# EasyEDA Pro project ProPrj_嵌赛国赛_2025-08-15.epro, schematic 药箱电源板

## Sheets
1 P1: Board Name: 药箱电源板; Create Date: 2025-07-22; Page Name: P1; Project Name: 嵌赛国赛; Schematic Name: 药箱电源板; Update Date: 2025-07-22; Company: 嘉立创EDA; Page Size: A4; Version: V1.0
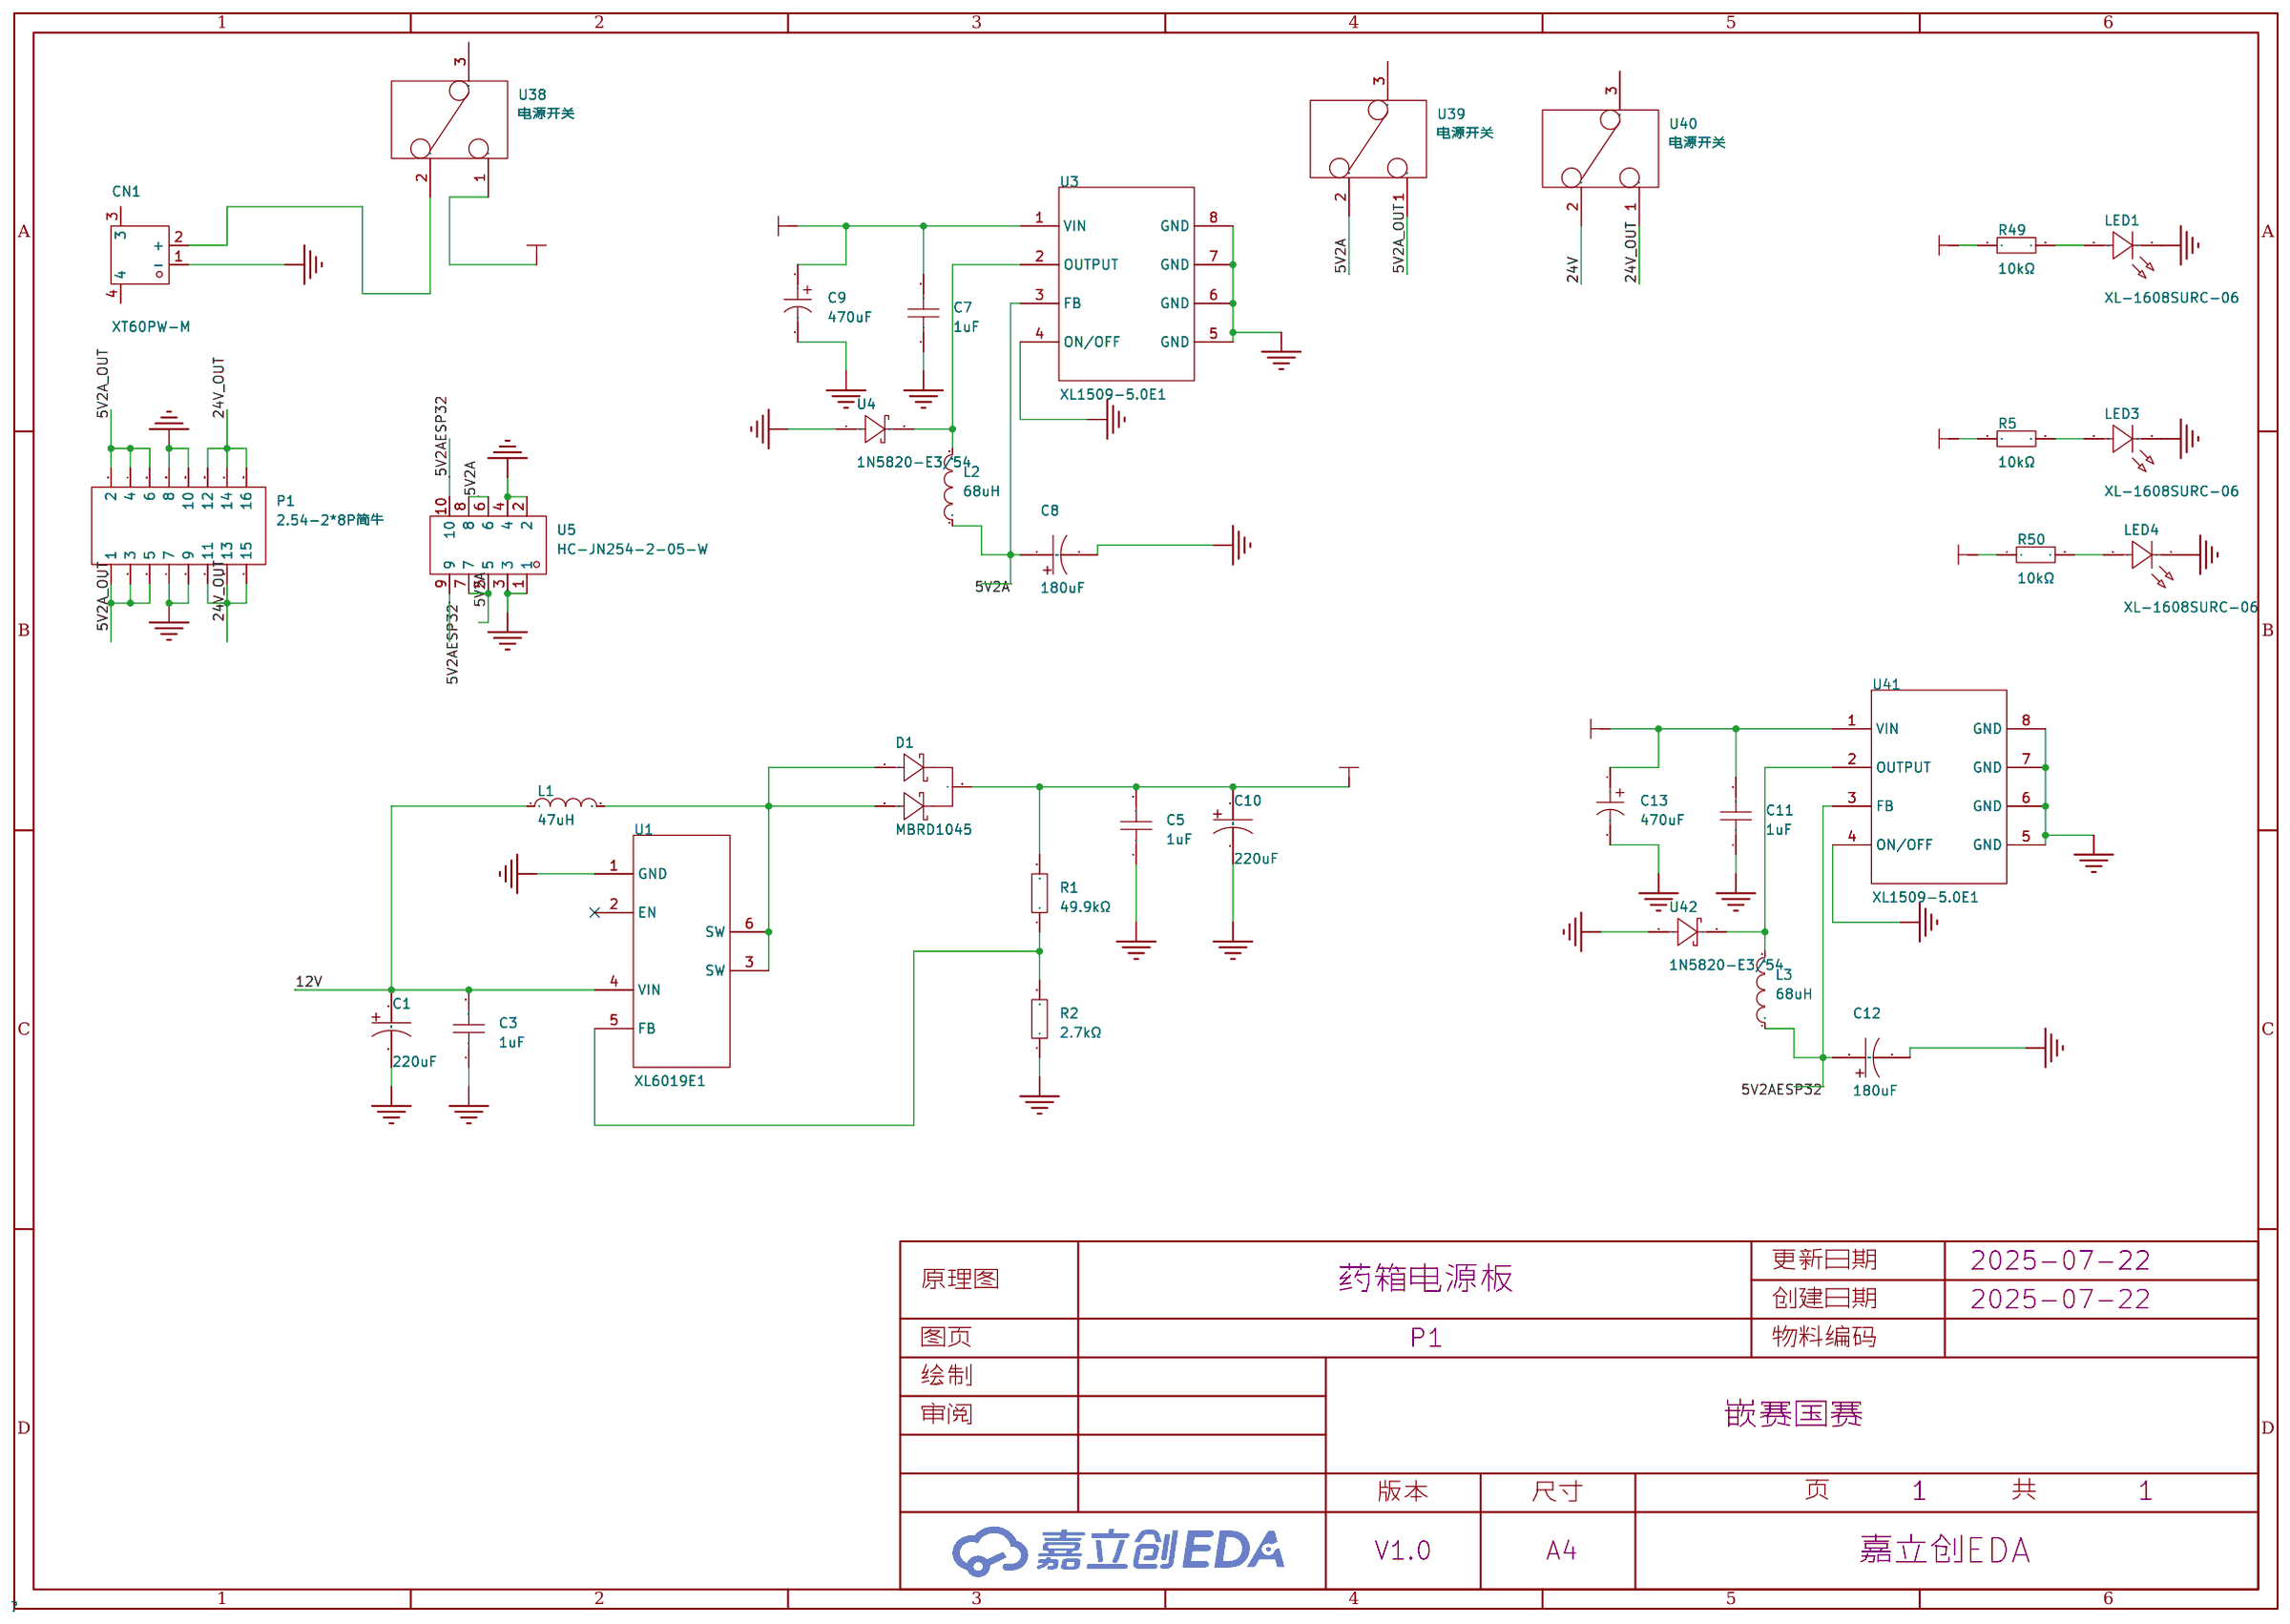
[diagram p6: P1]
2 P2: Page Name: P2
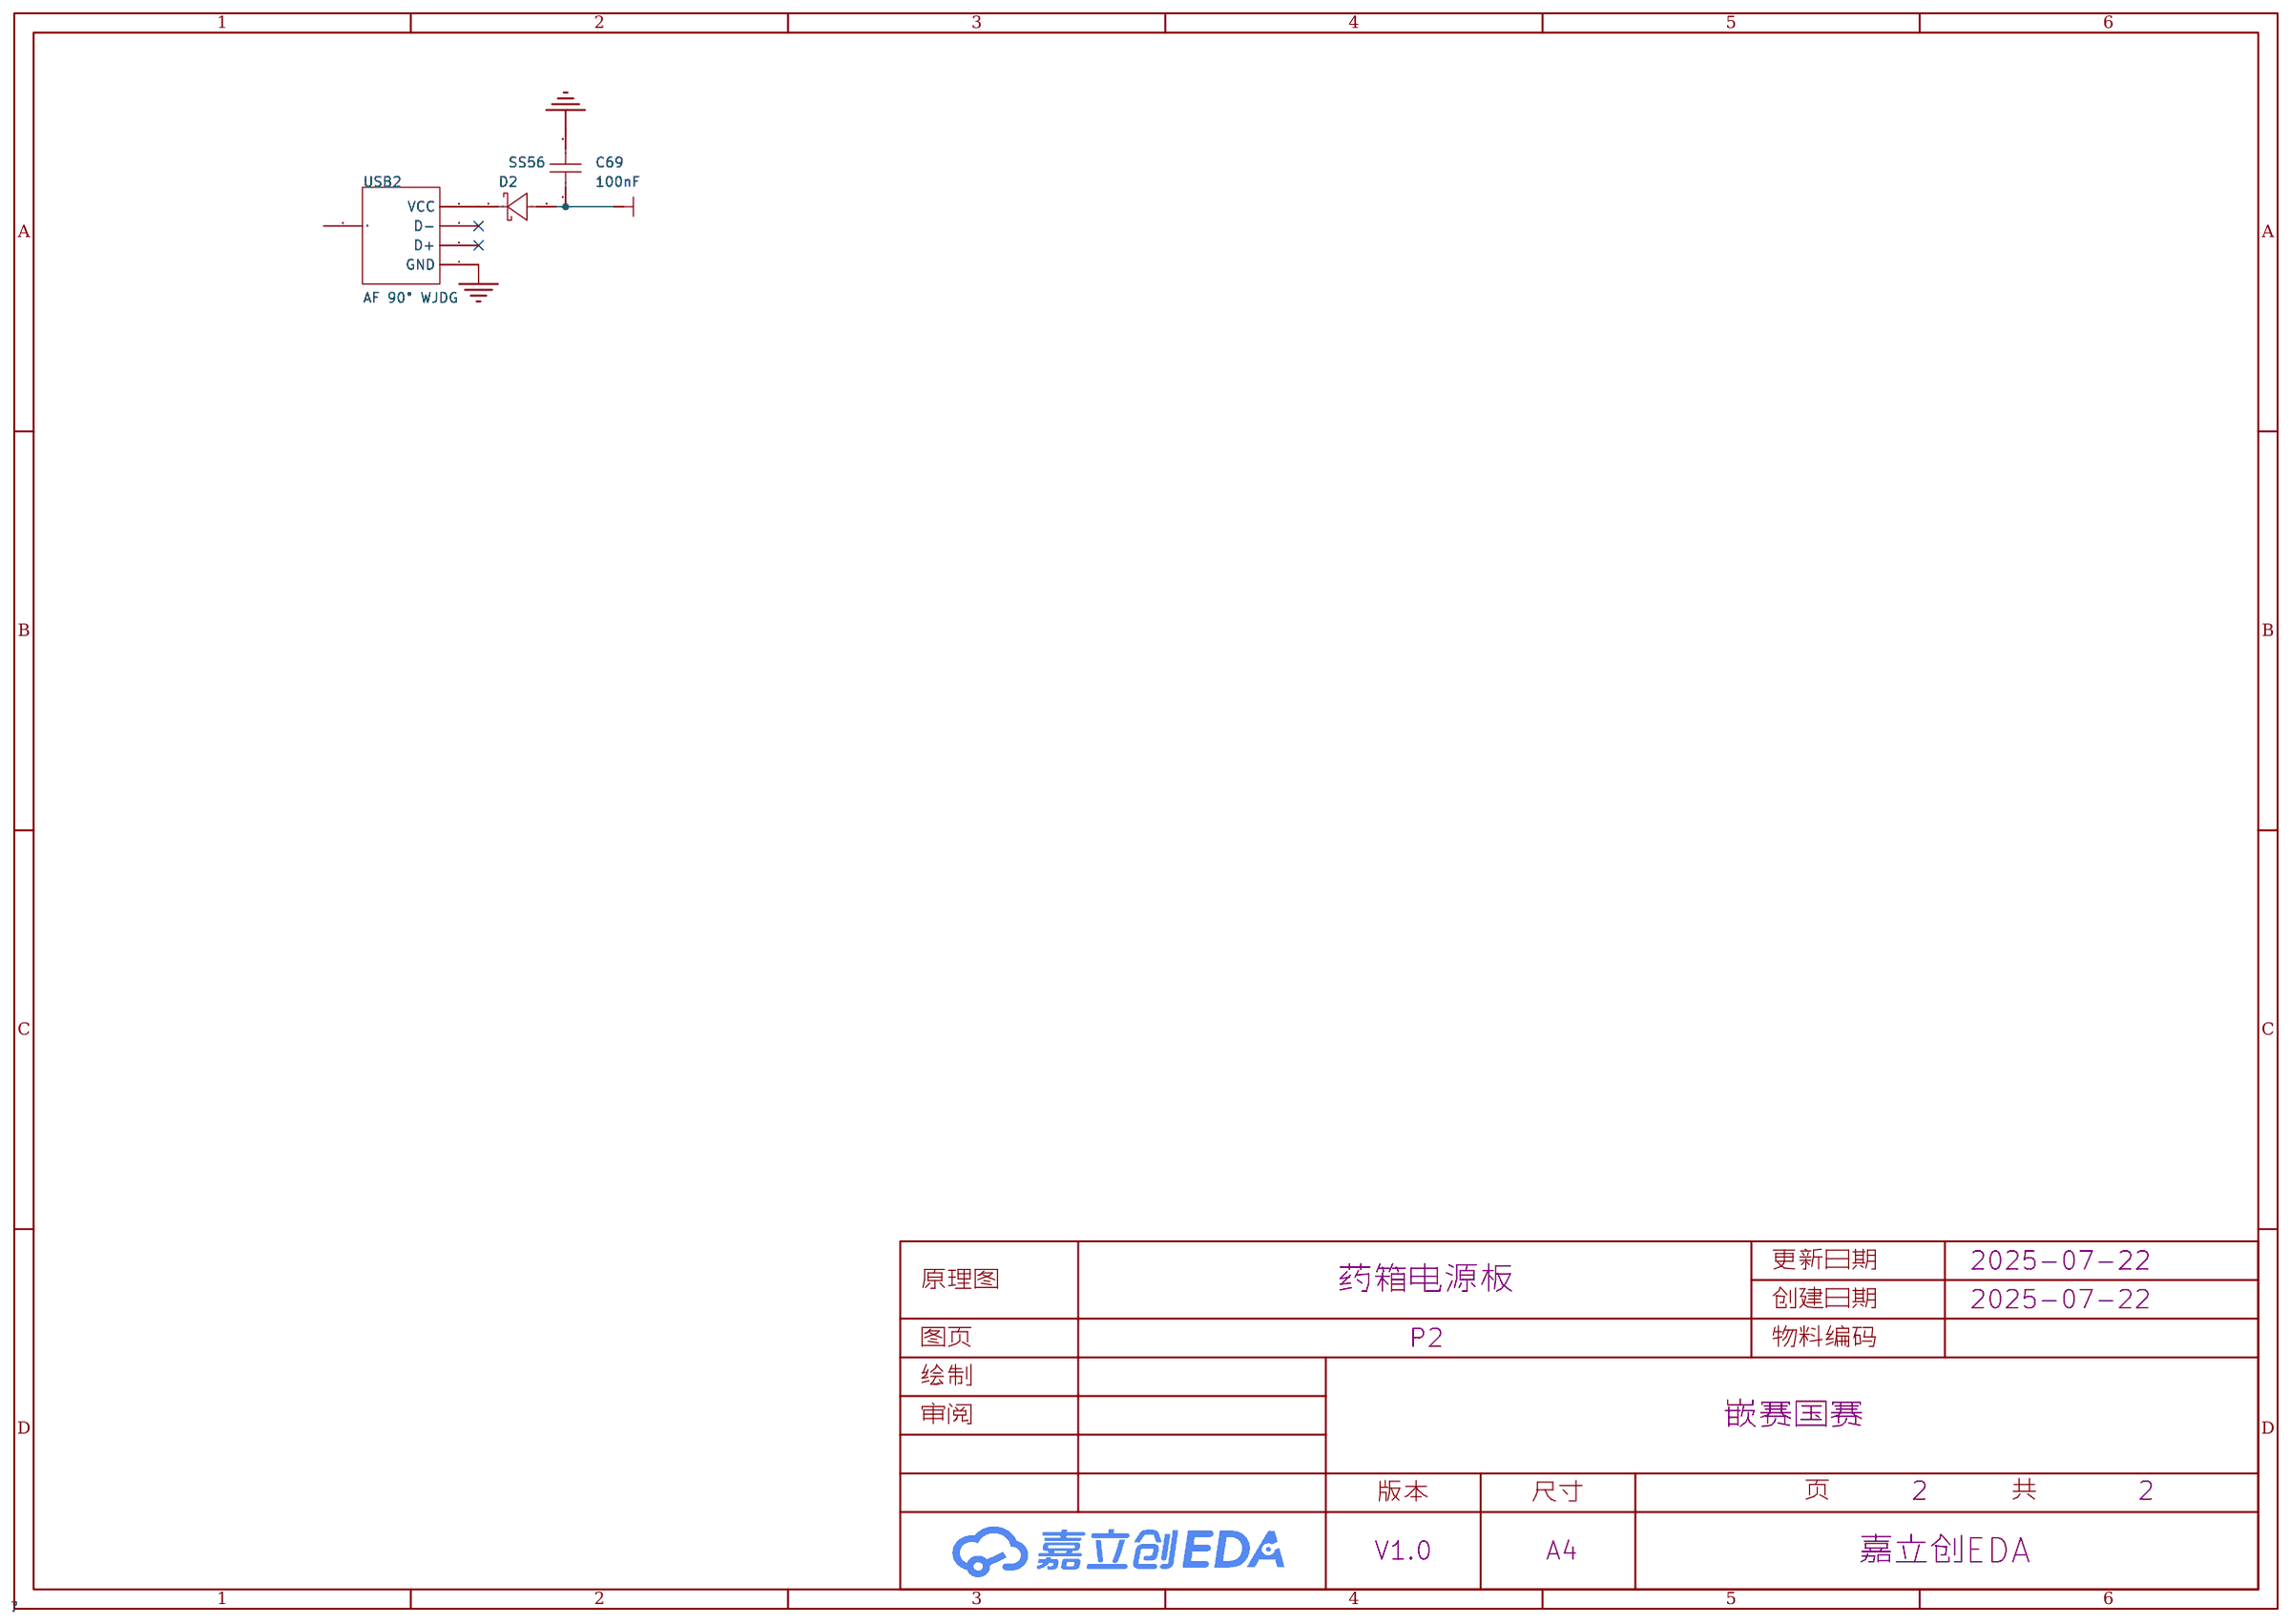
[diagram p7: P2]

## Parts
sheet P1
C1  680uF  [CAP-SMD_BD10.0-L10.3-W10.3-LS11.3-FD]
C3  1uF  [C0603]
C5  1uF  [C0603]
C7  1uF  [C0603]
C8  180uF  [CAP-TH_BD8.0-P3.50-D0.6-FD]
C9  470uF  [CAP-TH_BD8.0-P3.50-D0.6-FD_1]
C10  680uF  [CAP-SMD_BD10.0-L10.3-W10.3-LS11.3-FD]
C11  1uF  [C0603]
C12  180uF  [CAP-TH_BD8.0-P3.50-D0.6-FD]
C13  470uF  [CAP-TH_BD8.0-P3.50-D0.6-FD_1]
CN1  XT60PW-M  [CONN-TH_XT60PW-M]
D1  MBRD1045  [TO-252-3_L6.5-W5.9-P4.60-LS10.0-BL]
L1  47uH  [IND-SMD_L7.0-W6.6_FXL0630]
L2  68uH  [IND-SMD_L7.1-W6.6-1]
L3  68uH  [IND-SMD_L7.1-W6.6-1]
LED1  XL-1608SURC-06  [LED0603-RD_RED]
LED3  XL-1608SURC-06  [LED0603-RD_RED]
LED4  XL-1608SURC-06  [LED0603-RD_RED]
P1  2.54-2*8P简牛  [IDC-TH_16P-P2.54_C3406]
R1  49.9kΩ  [R0603]
R2  2.7kΩ  [R0603]
R5  10kΩ  [R0603]
R49  10kΩ  [R0603]
R50  10kΩ  [R0603]
U1  XL6019E1  [TO-263-5_L10.2-W9.9-P1.70-LS14.4-TL]
U3  XL1509-5.0E1  [SOIC-8_L5.0-W4.0-P1.27-LS6.0-BL]
U4  1N5820-E3/54  [DO-201AD_BD5.3-L8.4-P12.50-D1.4-FD]
U5  HC-JN254-2-05-W  [HDR-TH_10P-P2.54-H-F-R2-C5-W9.0]
U38  电源开关  [电源开关]
U39  电源开关  [电源开关]
U40  电源开关  [电源开关]
U41  XL1509-5.0E1  [SOIC-8_L5.0-W4.0-P1.27-LS6.0-BL]
U42  1N5820-E3/54  [DO-201AD_BD5.3-L8.4-P12.50-D1.4-FD]
sheet P2
C69  100nF  [C0603]
D2  SS56  [SMA_L4.3-W2.6-LS5.0-RD]
USB2  AF 90° WJDG  [USB-A-TH_AF-WJDG]

## Library data of the parts
C1 C10 = RVT1C681M1010: 容值:680uF;精度:±20%;额定电压:16V;纹波电流:-;等效串联电阻:-;; LCSC Part Name: 680uF ±20% 16V; Supplier Part: C335987; Manufacturer: ROQANG(容强); Supplier Footprint: SMD,D10xL10.2mm; JLCPCB Part Class: Extended Part; Datasheet: https://atta.szlcsc.com/upload/public/pdf/source/20181128/C335987_23CA7AA50FB42690DF736C43FE112376.pdf; Supplier: LCSC; Tolerance: ±20%; Rated Voltage: 16V; φD: 10mm; L: 10.2mm; Lifetime @ Temp: 2000hrs@105; Operating Temperature: -45~+105
C3 C5 = CL10A105KB8NNNC: 容值:1uF;精度:±10%;额定电压:50V;材质(温度系数):X5R;; LCSC Part Name: 1uF ±10% 50V; Supplier Part: C15849; Manufacturer: SAMSUNG(三星); Supplier Footprint: 0603; JLCPCB Part Class: 基础库; Datasheet: https://atta.szlcsc.com/upload/public/pdf/source/20160218/1457707763339.pdf; Supplier: LCSC; Tolerance: ±10%; Voltage Rated: 50V; Temperature Coefficient: X5R
C7 C11 = CGA0603X5R105K160JT: 容值:1uF;精度:±10%;额定电压:16V;材质(温度系数):X5R;; LCSC Part Name: 1uF ±10% 16V; Supplier Part: C6119849; Manufacturer: HRE(芯声); Supplier Footprint: 0603; JLCPCB Part Class: 扩展库; Supplier: LCSC; Tolerance: ±10%; Voltage Rated: 16V; Temperature Coefficient: X5R
C8 C12 = LKMD0901V181MF: 容值:180uF;精度:±20%;额定电压:35V;纹波电流:900mA@100kHz;等效串联电阻:210mΩ@100kHz;; LCSC Part Name: 180uF ±20% 35V; Supplier Part: C442870; Manufacturer: Ymin(永铭); Supplier Footprint: 插件,D8xL9mm; JLCPCB Part Class: 扩展库; Datasheet: https://atta.szlcsc.com/upload/public/pdf/source/20200220/C487520_443A40905984A455D375EE990FEAA9E8.pdf; Supplier: LCSC; Tolerance: ±20%; Rated Voltage: 35V; Ripple Current: 900mA@100kHz; Equivalent Series Resistance(ESR): 210mΩ@100kHz; Lead Spacing: 3.5mm; φD: 8mm; L: 9mm; Lifetime @ Temp: 10000hrs@105℃
C9 C13 = CD2884771EM0812VFL: 容值:470uF;额定电压:25V;; LCSC Part Name: 470uF 25V; Supplier Part: C2960233; Manufacturer: HRK(鸿瑞凯电子); Supplier Footprint: 插件,D8xL12mm; JLCPCB Part Class: 扩展库; Datasheet: https://atta.szlcsc.com/upload/public/pdf/source/20240703/D49961C1CEC6E325964F7113D69E9087.pdf; Supplier: LCSC; Rated Voltage: 25V; φD: 8mm; L: 12mm; Operating Temperature: -40℃~+105℃
CN1 = XT60PW-M: 类别:-;类型1:-;; LCSC Part Name: AMASS(艾迈斯)航模插头xt60连接器150公母对接pw锂电池公头 板插卧式XT60PW-M; Supplier Part: C98732; Manufacturer: AMASS(艾迈斯); JLCPCB Part Class: 扩展库; Datasheet: https://atta.szlcsc.com/upload/public/pdf/source/20240118/44A3DCFF53BE25DC65378AFFB21277A4.pdf; Supplier: LCSC; Brand: 艾迈斯; Type: 卧式插头; Colour: 黄色; InterfaceType: 公头
D1 = MBRD1045: 二极管配置:1对共阴极;正向压降(Vf):550mV@10A;直流反向耐压(Vr):45V;平均整流电流(Io):10A;; LCSC Part Name: 电压:45V 电流:10A; Supplier Part: C5137764; Manufacturer: GOODWORK(固得沃克); Supplier Footprint: TO-252; JLCPCB Part Class: 扩展库; Datasheet: https://atta.szlcsc.com/upload/public/pdf/source/20220811/0184EE9629AA1C466BA3600FC4FB457A.pdf; Supplier: LCSC; Diode Configuration: 1对共阴极; Forward Voltage (Vf@If): 550mV@10A; Reverse Voltage (Vr): 45V; Average Rectified Current (Io): 10A; Reverse Leakage Current (Ir): 100uA@45V
L1 = FXL0630-470-M: 电感值:47uH;精度:±20%;额定电流:1.5A;饱和电流(Isat):2A;类型:一体成型电感;; LCSC Part Name: 47uH ±20% 2A; Supplier Part: C475913; Manufacturer: cjiang(长江微电); Supplier Footprint: SMD,6.6x7mm; JLCPCB Part Class: 扩展库; Datasheet: https://atta.szlcsc.com/upload/public/pdf/source/20240426/3189EA8206330E2108542F9E34E540E7.pdf; Supplier: LCSC; Tolerance: ±20%; Rated Current: 1.5A; Saturation Current (Isat): 2A; DC Resistance (DCR): 385mΩ; Type: 一体成型电感
L2 L3 = PSPMAA0605H-680M-IGF: 电感值:68uH;精度:±20%;额定电流:2A;饱和电流(Isat):2.5A;; LCSC Part Name: 68uH ±20% 2.5A; Supplier Part: C2983094; Manufacturer: PROD(谱罗德); Supplier Footprint: SMD,6.6x7.1mm; JLCPCB Part Class: 扩展库; Datasheet: https://atta.szlcsc.com/upload/public/pdf/source/20220421/FA7B36985F5EDDBED7850D2E38F6BF27.pdf; Supplier: LCSC; Tolerance: ±20%; Rated Current: 2A; Saturation Current (Isat): 2.5A; DC Resistance (DCR): 256mΩ; Ratings: AEC-Q200
LED1 LED3 LED4 = XL-1608SURC-06: 发光颜色:红色;功率:55mW;正向电流:25mA;主波长:617nm~621nm;透镜颜色:无色透明透镜;色温:-;发光角度:120°;载带方式:正贴;工作温度:-30℃~+85℃;; Supplier Part: C965799; Manufacturer: XINGLIGHT(成兴光); Supplier Footprint: 0603; JLCPCB Part Class: 扩展库; Datasheet: https://atta.szlcsc.com/upload/public/pdf/source/20221102/D860AFDD1CDB02C5A8064103A32707E2.pdf; Supplier: LCSC; Emitted Color: 红色; Power Dissipation: 55mW; Forward Current: 25mA; Dominant Wavelength: 617nm~621nm; Peak Wavelength: 623nm; Lens Color: 无色透明透镜; Viewing Angle: 120°; Mounting Sytle: 正贴; Operating Temperature: -30℃~+85℃
P1 = 2.54-2*8P简牛: 连接器类型:简牛座;间距:2.54mm;结构:2x8P;封装形式:直插;行距:2.54mm;排数:2;每排PIN数:8;触头材质:-;触头镀层:-;; LCSC Part Name: 2.54mm 2x8P 排数:2 每排P数:8; Supplier Part: C3406; Manufacturer: BOOMELE(博穆精密); Supplier Footprint: 插件,P=2.54mm; JLCPCB Part Class: 扩展库; Datasheet: https://atta.szlcsc.com/upload/public/pdf/source/20131122/1457706661483.pdf; Supplier: LCSC; Connector Type: 简牛座; Pitch: 2.54mm; Structure: 2x8P; Holder Type: 直插; Row Spacing: 2.54mm; Number of Rows: 2; Pin Number in each Row: 8
R1 R2 = 0603WAF4992T5E: 电阻类型:厚膜电阻;阻值:49.9kΩ;精度:±1%;功率:100mW;最大工作电压:75V;温度系数:±100ppm/℃;; LCSC Part Name: 49.9kΩ ±1% 100mW 厚膜电阻; Supplier Part: C23184; Manufacturer: UNI-ROYAL(厚声); Supplier Footprint: 0603; JLCPCB Part Class: Basic Part; Datasheet: https://atta.szlcsc.com/upload/public/pdf/source/20200306/C422600_1E6D84923E4A46A82E41ADD87F860B5C.pdf; Supplier: LCSC; Type: 厚膜电阻; Tolerance: ±1%; Power(Watts): 100mW; Overload Voltage (Max): 75V; Temperature Coefficient: ±100ppm/℃; Operating Temperature Range: -55℃~+155℃
R5 R49 R50 = 0603WAF1002T5E: 电阻类型:厚膜电阻;阻值:10kΩ;精度:±1%;功率:100mW;最大工作电压:75V;温度系数:±100ppm/℃;; LCSC Part Name: 厚膜电阻 10kΩ ±1% 100mW; Supplier Part: C25804; Manufacturer: UNI-ROYAL(厚声); Supplier Footprint: 0603; JLCPCB Part Class: Basic Part; Datasheet: https://atta.szlcsc.com/upload/public/pdf/source/20200306/C422600_1E6D84923E4A46A82E41ADD87F860B5C.pdf; Supplier: LCSC; Type: 厚膜电阻; Tolerance: ±1%; Power(Watts): 100mW; Overload Voltage (Max): 75V; Temperature Coefficient: ±100ppm/℃; Operating Temperature Range: -55℃~+155℃
U1 = XL6019E1: 功能类型:升压型;输出类型:-;输入电压:5V~40V;输出电压:60V;输出电流(最大值):5A;; Supplier Part: C73018; Manufacturer: XLSEMI(芯龙); Supplier Footprint: TO-263-5; JLCPCB Part Class: 扩展库; Datasheet: https://atta.szlcsc.com/upload/public/pdf/source/20230915/0F37A40A07D65557F92F701F29EBE038.pdf; Supplier: LCSC; Function: 升压型; Input Voltage: 5V~40V; Output Voltage: 60V; Output Current (Max): 5A; Switching Frequency: 180kHz; Synchronous Rectification: 否; Number of Outputs: 1; Topology: 升压式; Switch tube (built-in/external): 内置
U3 U41 = XL1509-5.0E1: 功能类型:降压型;输入电压:4.5V~40V;输出电流:2A;; LCSC Part Name: 2A 150KHz 40V 降压 DC-DC 转换器; Supplier Part: C61063; Manufacturer: XLSEMI(芯龙); Supplier Footprint: SOIC-8; JLCPCB Part Class: 基础库; Datasheet: https://atta.szlcsc.com/upload/public/pdf/source/20151126/1457707596805.pdf; Supplier: LCSC; Function: 降压型; Input Voltage: 4.5V~40V; Output Current: 2A; Switching Frequency: 150kHz; Operating Temperature: -40℃~+125℃@(TJ); Number of Outputs: 1; Topology: 降压式; Switch tube (built-in/external): 内置
U4 U42 = 1N5820-E3/54: 正向压降(Vf):475mV@3A;直流反向耐压(Vr):20V;整流电流:3A;; LCSC Part Name: 电压:20V 电流:3A; Supplier Part: C5357977; Manufacturer: VISHAY(威世); Supplier Footprint: DO-201AD; JLCPCB Part Class: Extended Part; Datasheet: https://atta.szlcsc.com/upload/public/pdf/source/20231213/4CD9FBE9F25054130E4EF21C8CAD5061.pdf; Supplier: LCSC; Forward Voltage (Vf@If): 475mV@3A; Reverse Voltage (Vr): 20V; Rectified Current: 3A; Reverse Leakage Current (Ir): 2mA@20V
U5 = HC-JN254-2-05-W: 连接器类型:简牛座;间距:2.54mm;结构:2x5P;额定电流:3A;额定电压:-;封装形式:弯插;行距:2.54mm;排数:2;每排PIN数:5;触头材质:黄铜;触头镀层:金;工作温度范围:-40℃~+105℃;焊接温度(最大值):260℃@10S;; LCSC Part Name: 2.54mm 2x5P 排数:2 每排P数:5; Supplier Part: C5372873; Manufacturer: HCTL(华灿天禄); Supplier Footprint: 弯插,P=2.54mm; JLCPCB Part Class: 扩展库; Datasheet: https://atta.szlcsc.com/upload/public/pdf/source/20230314/29278A24539954283B80828B9C32CD4C.pdf; Supplier: LCSC; Connector Type: 简牛座; Pitch: 2.54mm; Structure: 2x5P; Current Rating (Max): 3A; Holder Type: 弯插; Row Spacing: 2.54mm; Number of Rows: 2; Pin Number in each Row: 5; Contact Material: 黄铜; Contact Plating: 金; Operating Temperature Range: -40℃~+105℃; Soldering Temperature(Max): 260℃@10S
U38-U40 = 电源开关
C69 = CC0603KRX7R9BB104: 容值:100nF;精度:±10%;额定电压:50V;材质(温度系数):X7R;; LCSC Part Name: 100nF ±10% 50V; Supplier Part: C14663; Manufacturer: YAGEO(国巨); Supplier Footprint: 0603; JLCPCB Part Class: Basic Part; Datasheet: https://atta.szlcsc.com/upload/public/pdf/source/20180910/C282072_33301C7F631E79921B82A8DAC6BCC5B3.pdf; Supplier: LCSC; Tolerance: ±10%; Voltage Rated: 50V; Temperature Coefficient: X7R
D2 = SS56_C18199169: 二极管配置:独立式;正向压降(Vf):700mV@5.0A;直流反向耐压(Vr):60V;整流电流:5A;; LCSC Part Name: 电压:60V 电流:5A; Supplier Part: C18199169; Manufacturer: 宏迦橙; Supplier Footprint: SMA(DO-214AC); JLCPCB Part Class: 扩展库; Datasheet: https://atta.szlcsc.com/upload/public/pdf/source/20230828/254C3882F8647358AD9F60DD73611B5E.pdf; Supplier: LCSC; Diode Configuration: 独立式; Forward Voltage (Vf@If): 700mV@5.0A; Reverse Voltage (Vr): 60V; Rectified Current: 5A; Reverse Leakage Current (Ir): 200uA@60V
USB2 = AF 90° WJDG: 连接器类型:Type-A;标准:USB 2.0;公母:母;安装方式:弯插;触点数量:4P;端口数量:1;额定电流 - 电源:1.5A;工作温度范围:-25℃~+85℃;; LCSC Part Name: Type-A 母 弯插; Supplier Part: C456018; Manufacturer: SHOU HAN(首韩); Supplier Footprint: 插件; JLCPCB Part Class: 扩展库; Datasheet: https://atta.szlcsc.com/upload/public/pdf/source/20241125/1CC41152EE29FFE03A5868591A920D3B.pdf; Supplier: LCSC; Connector Type: Type-A; Standard: USB 2.0; Gender: 母; Mounting Style: 弯插; Number of Contacts: 4P; Number of Ports: 1; Current Rating - Power (Max): 1.5A; Rated Voltage (Max): 30V; Connect-Disconnect Life: 5千次; Length: 14mm; Core Colour: 白色; Operating Temperature Range: -25℃~+85℃

## Nets
5V2A: C8.1 L2.1 U3.3(FB) U5.5 U5.6 U5.7 U5.8 U39.2
5V2A_OUT: P1.1 P1.2 P1.3 P1.4 P1.5 P1.6 R5.1 U39.1
5V2AESP32: C12.1 C69.1 D2.2(A) L3.1 U5.9 U5.10 U41.3(FB)
12V: C1.1 C3.2 C7.2 C9.1 C11.2 C13.1 L1.1 R49.1 U1.4(VIN) U3.1(VIN) U38.1 U41.1(VIN)
24V: C5.2 C10.1 D1.2(K) R1.2 U40.2
24V_OUT: P1.11 P1.12 P1.13 P1.14 P1.15 P1.16 R50.1 U40.1
GND: C1.2 C3.1 C5.1 C7.1 C8.2 C9.2 C10.2 C11.1 C12.2 C13.2 C69.2 CN1.1(-) LED1.1(K) LED3.1(K) LED4.1(K) P1.7 P1.8 P1.9 P1.10 R2.1 U1.1(GND) U3.4(ON/OFF) U3.5(GND) U3.6(GND) U3.7(GND) U3.8(GND) U4.1(A) U5.1 U5.2 U5.3 U5.4 U41.4(ON/OFF) U41.5(GND) U41.6(GND) U41.7(GND) U41.8(GND) U42.1(A) USB2.4(GND)
$1N866: CN1.2(+) U38.2
$1N873: LED1.2(A) R49.2
$1N876: LED3.2(A) R5.2
$1N885: L2.2 U3.2(OUTPUT) U4.2(C)
$1N2658: R1.1 R2.2 U1.5(FB)
$1N2663: D1.1(A) D1.3(A) L1.2 U1.3(SW) U1.6(SW)
$1N2780: LED4.2(A) R50.2
$1N3998: L3.2 U41.2(OUTPUT) U42.2(C)
$2N230: D2.1(K) USB2.1(VCC)

Not connected (* = marked no-connect by the designer): CN1 3 4; U1 2(EN)*; U38 3; U39 3; U40 3; USB2 2(D-)* 3(D+)* 5(SHLD)
